# Altium schematic sheet Power_Distribution_2021_3V3.SchDoc
size A; SheetNumber: 2; SheetTotal: 4
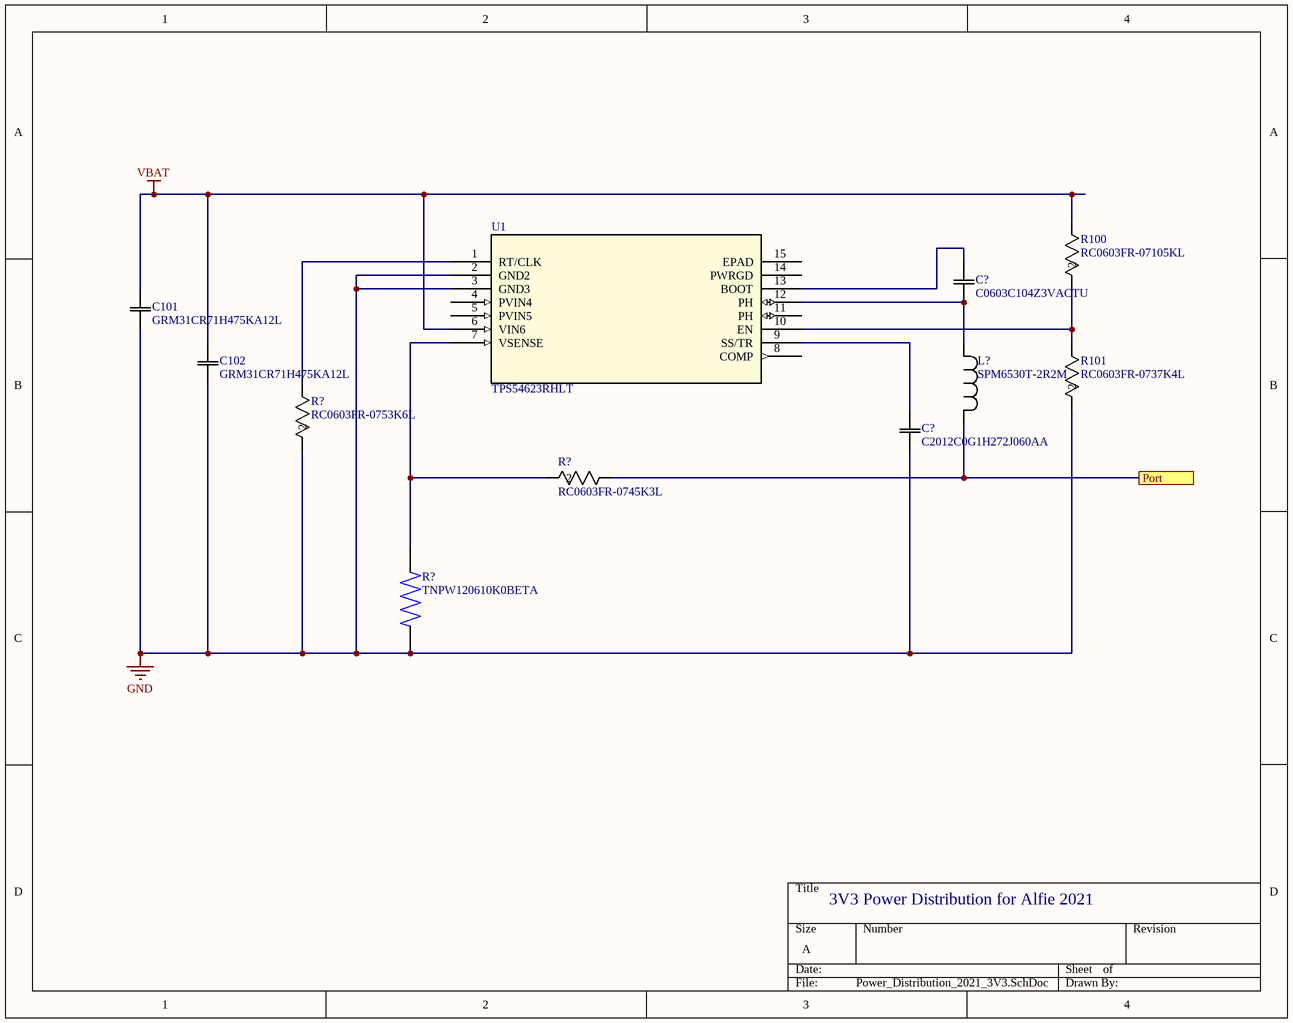
[diagram p0: Power_Distribution_2021_3V3.SchDoc]

## Parts
(Parts that share a designator on the sheet are numbered #1, #2 ... from top to bottom, then left to right.)
C101  GRM31CR71H475KA12L  [G-31_MUR]
C102  GRM31CR71H475KA12L  [G-31_MUR]
C?#1  C0603C104Z3VACTU  [CAPC17595_90N_KEM]
C?#2  C2012C0G1H272J060AA  [CAP_2012_TDK]
L?  SPM6530T-2R2M
R100  RC0603FR-07105KL  [RC0603N_YAG]
R101  RC0603FR-0737K4L  [RC0603N_YAG]
R?#1  RC0603FR-0753K6L  [RC0603N_YAG]
R?#2  RC0603FR-0745K3L  [RC0603N_YAG]
R?#3  TNPW120610K0BETA  [RESC3216X65N]
U1  TPS54623RHLT  [RHL14_2P05X2P05]

## Ports
Port

## Nets
GND: C101.1 C102.1 C?#2.1 R101.2 R?#1.2 R?#3.1 U1.2(GND2) U1.3(GND3)
VBAT: C101.2 C102.2 R100.1 U1.6(VIN6)
Port: L?.1 R?#2.1 ; port Port
NetC?#1_1: C?#1.1 U1.13(BOOT)
NetC?#1_2: C?#1.2 L?.2 U1.12(PH)
NetC?#2_2: C?#2.2 U1.9(SS/TR)
NetR100_2: R100.2 R101.1 U1.10(EN)
NetR?#1_1: R?#1.1 U1.1(RT/CLK)
NetR?#2_2: R?#2.2 R?#3.2 U1.7(VSENSE)

Not connected (* = marked no-connect by the designer): U1 4(PVIN4) 5(PVIN5) 8(COMP) 11(PH) 14(PWRGD) 15(EPAD)

## Notes on the sheet
- 3V3 Power Distribution for Alfie 2021

## Library data of the parts
C101 C102 = GRM31CR71H475KA12L: CAP CER 4.7UF 50V X7R 1206; Mfr_Name: Murata; Type: DEV; Copyright: Copyright (C) 2021 Ultra Librarian. All rights reserved.; Manufacturer_Part_Number: GRM31CR71H475KA12L; Digi-Key_Part_Number_1: 490-6521-1-ND; Digi-Key_Part_Number_2: 490-6521-2-ND; Digi-Key_Part_Number_3: 490-6521-6-ND; RefDes: RefDes
C?#1 = C0603C104Z3VACTU: CAP CER 0.1UF 25V Y5V 0603; Mfr_Name: Kemet; Type: DEV; Copyright: Copyright (C) 2021 Ultra Librarian. All rights reserved.; Manufacturer_Part_Number: C0603C104Z3VACTU; Digi-Key_Part_Number_1: 399-1100-1-ND; Digi-Key_Part_Number_2: 399-1100-2-ND; Digi-Key_Part_Number_3: 399-1100-6-ND; RefDes: RefDes
C?#2 = C2012C0G1H272J060AA: CAP CER 2700PF 50V C0G 0805; Mfr_Name: TDK; Type: DEV; Copyright: Copyright (C) 2021 Ultra Librarian. All rights reserved.; Manufacturer_Part_Number: C2012C0G1H272J060AA; Digi-Key_Part_Number_1: 445-7508-1-ND; Digi-Key_Part_Number_2: 445-7508-2-ND; Digi-Key_Part_Number_3: 445-7508-6-ND; RefDes: RefDes
L? = SPM6530T-2R2M: FIXED IND 2.2UH 8.2A 19 MOHM SMD; Mfr_Name: TDK; Copyright: Copyright (C) 2021 Ultra Librarian. All rights reserved.; Manufacturer_Part_Number: SPM6530T-2R2M; Digi-Key_Part_Number_1: 445-4118-1-ND; Digi-Key_Part_Number_2: 445-4118-2-ND; Digi-Key_Part_Number_3: 445-4118-6-ND
R100 = RC0603FR-07105KL: RES SMD 105K OHM 1% 1/10W 0603; Mfr_Name: Yageo; Copyright: Copyright (C) 2021 Ultra Librarian. All rights reserved.; Manufacturer_Part_Number: RC0603FR-07105KL; Digi-Key_Part_Number_1: 311-105KHRCT-ND; Digi-Key_Part_Number_2: 311-105KHRDKR-ND; Digi-Key_Part_Number_3: 311-105KHRTR-ND; RefDes: RefDes; Type: DEV
R101 = RC0603FR-0737K4L: RES SMD 37.4K OHM 1% 1/10W 0603; Mfr_Name: Yageo; Copyright: Copyright (C) 2021 Ultra Librarian. All rights reserved.; Manufacturer_Part_Number: RC0603FR-0737K4L; Digi-Key_Part_Number_1: 311-37.4KHRCT-ND; Digi-Key_Part_Number_2: 311-37.4KHRDKR-ND; Digi-Key_Part_Number_3: 311-37.4KHRTR-ND; Digi-Key_Part_Number_4: 311-37.4KHRTR-NDL; RefDes: RefDes; Type: DEV
R?#1 = RC0603FR-0753K6L: RES SMD 53.6K OHM 1% 1/10W 0603; Mfr_Name: Yageo; Copyright: Copyright (C) 2021 Ultra Librarian. All rights reserved.; Manufacturer_Part_Number: RC0603FR-0753K6L; Digi-Key_Part_Number_1: 311-53.6KHRCT-ND; Digi-Key_Part_Number_2: 311-53.6KHRDKR-ND; Digi-Key_Part_Number_3: 311-53.6KHRTR-ND; RefDes: RefDes; Type: DEV
R?#2 = RC0603FR-0745K3L: RES SMD 45.3K OHM 1% 1/10W 0603; Mfr_Name: Yageo; Copyright: Copyright (C) 2021 Ultra Librarian. All rights reserved.; Manufacturer_Part_Number: RC0603FR-0745K3L; Digi-Key_Part_Number_1: 311-45.3KHRCT-ND; Digi-Key_Part_Number_2: 311-45.3KHRDKR-ND; Digi-Key_Part_Number_3: 311-45.3KHRTR-ND; Digi-Key_Part_Number_4: 311-45.3KHRTR-NDL; RefDes: RefDes; Type: DEV
R?#3 = TNPW120610K0BETA: Res Thin Film 1206 10K Ohm 0.1% 0.25W(1/4W) ?25ppm/C Molded SMD T/R; Package: None; Price: None; Value: *; MP: TNPW120610K0BETA; Availability: Unavailable
U1 = TPS54623RHLT: No Description Available; Mfr_Name: Texas Instruments; Copyright: Copyright (C) 2021 Ultra Librarian. All rights reserved.; Manufacturer_Part_Number: TPS54623RHLT; Digi-Key_Part_Number_1: 296-29679-1-ND; Digi-Key_Part_Number_2: 296-29679-2-ND; Digi-Key_Part_Number_3: 296-29679-6-ND; RefDes: RefDes; Type: DEV